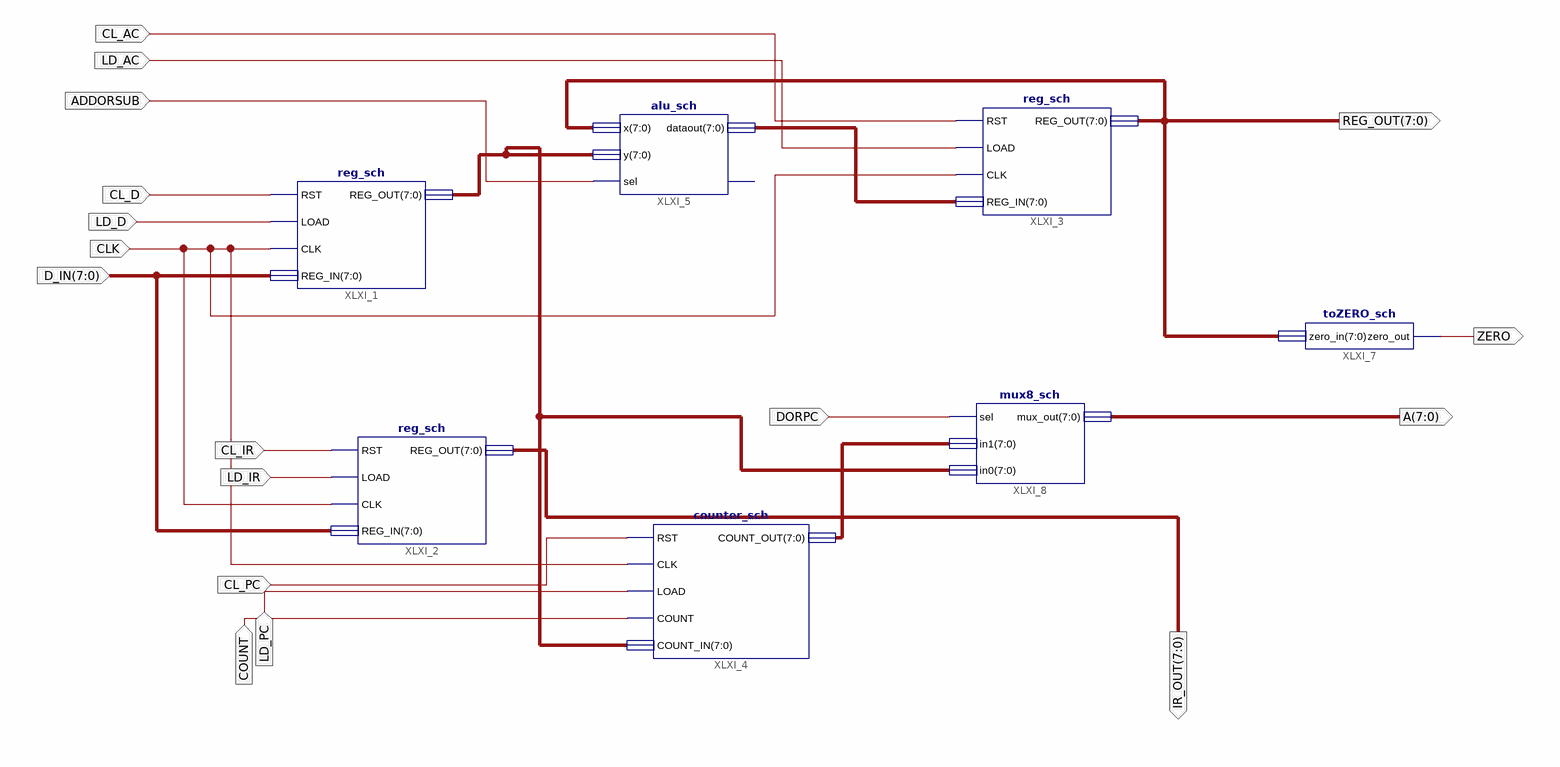
[diagram p0: schematic sheet 1]
// Xilinx ISE schematic Datapath.sch (spartan3e) as structural Verilog: 7 symbols, 17 ports
module Datapath (
  input  DORPC,
  input  CL_D,
  input  LD_D,
  input  [7:0] D_IN,
  input  CL_PC,
  input  CLK,
  input  LD_PC,
  input  COUNT,
  input  LD_AC,
  input  CL_AC,
  input  ADDORSUB,
  input  CL_IR,
  input  LD_IR,
  output [7:0] IR_OUT,
  output [7:0] A,
  output ZERO,
  output [7:0] REG_OUT
);

  wire [7:0] XLXN_2, XLXN_32, XLXN_39;

  reg_sch XLXI_1 (.RST(CL_D), .LOAD(LD_D), .CLK(CLK), .REG_IN(D_IN), .REG_OUT(XLXN_39));
  reg_sch XLXI_2 (.RST(CL_IR), .LOAD(LD_IR), .CLK(CLK), .REG_IN(D_IN), .REG_OUT(IR_OUT));
  reg_sch XLXI_3 (.RST(CL_AC), .LOAD(LD_AC), .CLK(CLK), .REG_IN(XLXN_32), .REG_OUT(REG_OUT));
  counter_sch XLXI_4 (.RST(CL_PC), .CLK(CLK), .LOAD(LD_PC), .COUNT(COUNT), .COUNT_IN(XLXN_39), .COUNT_OUT(XLXN_2));
  alu_sch XLXI_5 (.x(REG_OUT), .y(XLXN_39), .sel(ADDORSUB), .dataout(XLXN_32));  // open: cnext
  toZERO_sch XLXI_7 (.zero_in(REG_OUT), .zero_out(ZERO));
  mux8_sch XLXI_8 (.sel(DORPC), .in1(XLXN_2), .in0(XLXN_39), .mux_out(A));
endmodule
